# Altium schematic sheet LPF-DAC.SchDoc: Low Pass Filters
size A4; Date: 27.09.2023; ApprovedBy: M.Sc. Tobias Wirth; CheckedBy: M.Sc. Tobias Wirth; Author: M.Sc. Tobias Wirth; CompanyName: University of Stuttgart; DrawnBy: M.Sc. Tobias Wirth; Engineer: M.Sc. Tobias Wirth; Organization: IIS; Address1: Pfaffenwaldring 47; Address2: 70569 Stuttgart; Revision: V1.1; SheetNumber: 6; SheetTotal: 17; ProjectNameAlt: AUS - NMR System; Time: 17:25; ImagePath: N/A; Application_BuildNumber: N/A
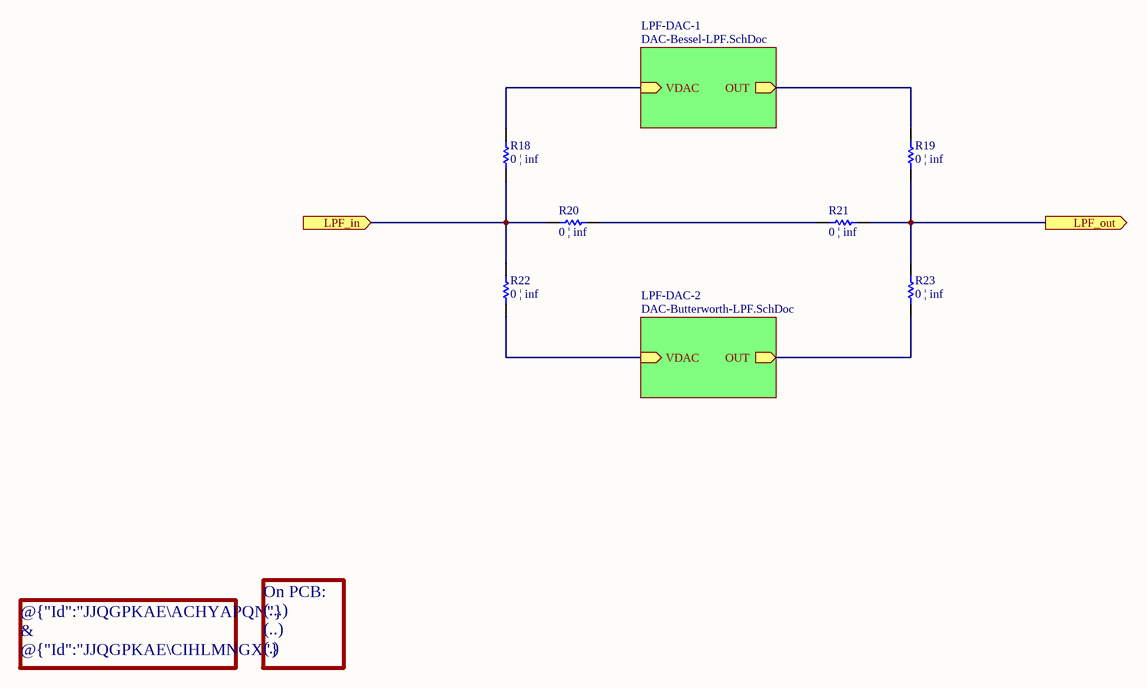
[diagram p0: LPF-DAC.SchDoc]

## Parts
R18  0 | inf  [RES_0402]
R19  0 | inf  [RES_0402]
R20  0 | inf  [RES_0402]
R21  0 | inf  [RES_0402]
R22  0 | inf  [RES_0402]
R23  0 | inf  [RES_0402]

## Sub-sheets
LPF-DAC-1 = DAC-Bessel-LPF.SchDoc: OUT (out), VDAC (in)
LPF-DAC-2 = DAC-Butterworth-LPF.SchDoc: OUT (out), VDAC (in)

## Ports
LPF_in (in), LPF_out (out)

## Nets
LPF_in: R18.1 R20.2 R22.2 ; port LPF_in
LPF_out: R19.1 R21.1 R23.2 ; port LPF_out
NetR18_2: R18.2 ; sheet LPF-DAC-1/VDAC
NetR19_2: R19.2 ; sheet LPF-DAC-1/OUT
NetR20_1: R20.1 R21.2
NetR22_1: R22.1 ; sheet LPF-DAC-2/VDAC
NetR23_1: R23.1 ; sheet LPF-DAC-2/OUT

## Notes on the sheet
- @{"Id":"JJQGPKAE\ACHYAPQN"} & @{"Id":"JJQGPKAE\CIHLMNGX"} = 12MHz LPF
  @{"Id":"JJQGPKAE\RXMNZDDT"} & @{"Id":"JJQGPKAE\XXOJJDQD"} = 4MHz LPF
  @{"Id":"JJQGPKAE\JBMYEHPT"} & @{"Id":"JJQGPKAE\TDMOEGAY"} = Ommit LPFs
- On PCB:
  (...)
  (..)
  (.)
- Title
- Size
- Date:
- Sheet
- A4
- of
- Project
- Drawn By:
- Revision:

## Library data of the parts
R18-R23 = Res: Part Number: *; Supplier: *; Value: 0 | inf